# Altium schematic sheet LED_Wall [Audio].SchDoc
size Letter
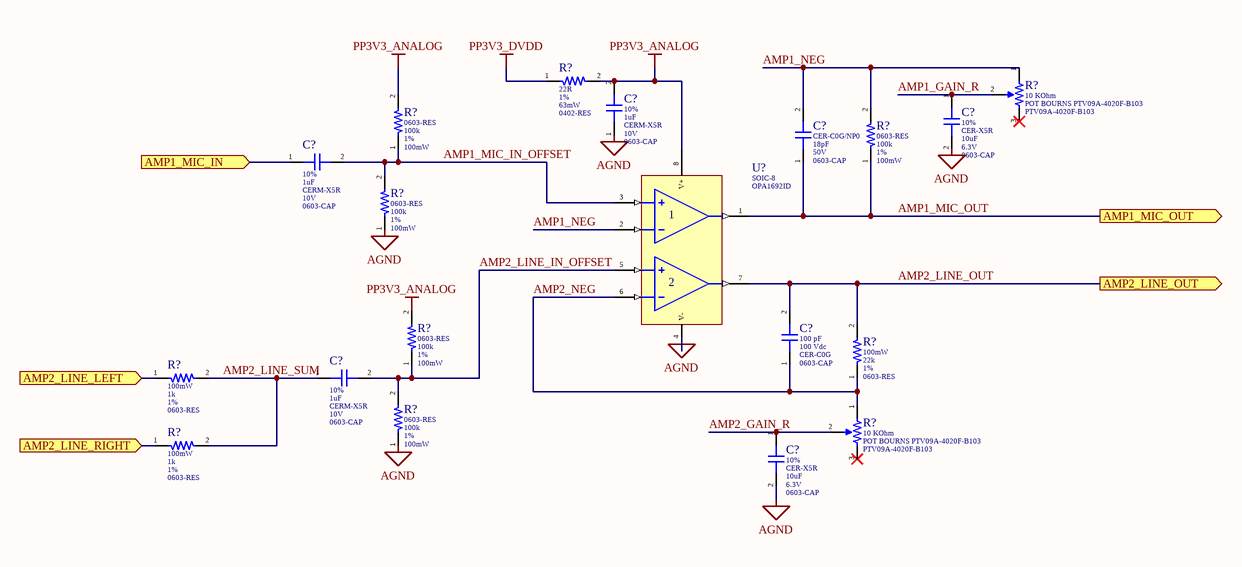
[diagram p0: LED_Wall [Audio].SchDoc]

## Parts
(Parts that share a designator on the sheet are numbered #1, #2 ... from top to bottom, then left to right.)
C?#1  Tolerance: 10%  Capacitance: 1uF  Dielectric: CERM-X5R  Voltage: 10V  [0603-CAP]  (hidden comment: CAP SAMSUNG CL10A105KP8NNNC)
C?#2  Tolerance: 10%  Dielectric: CER-X5R  Capacitance: 10uF  Voltage Rating: 6.3V  [0603-CAP]  (hidden comment: CAP MURATA GRM188R60J106KE47D)
C?#3  Dielectric: CER-C0G/NP0  Capacitance: 18pF  Voltage - Rated: 50V  [0603-CAP]  (hidden comment: CAP YAGEO CC0603JRNPO9BN180)
C?#4  Tolerance: 10%  Capacitance: 1uF  Dielectric: CERM-X5R  Voltage: 10V  [0603-CAP]  (hidden comment: CAP SAMSUNG CL10A105KP8NNNC)
C?#5  Capacitance Value: 100 pF  Voltage: 100 Vdc  Dielectric: CER-C0G  [0603-CAP]  (hidden comment: CAP KEMET C0603C101J1GACTU)
C?#6  Tolerance: 10%  Capacitance: 1uF  Dielectric: CERM-X5R  Voltage: 10V  [0603-CAP]  (hidden comment: CAP SAMSUNG CL10A105KP8NNNC)
C?#7  Tolerance: 10%  Dielectric: CER-X5R  Capacitance: 10uF  Voltage Rating: 6.3V  [0603-CAP]  (hidden comment: CAP MURATA GRM188R60J106KE47D)
R?#1  Resistance: 22R  Tolerance: 1%  Power Rating: 63mW  [0402-RES]  (hidden comment: RES YAGEO RC0402FR-0722RL)
R?#2  Resistance Value: 10 KOhm  Manufacturer Part Number: PTV09A-4020F-B103  [POT BOURNS PTV09A-4020F-B103]  (hidden comment: POT BOURNS PTV09A-4020F-B103)
R?#3  Resistance: 100k  Tolerance: 1%  Power: 100mW  [0603-RES]  (hidden comment: RES BOURNS CR0603AFX-1003EAS)
R?#4  Resistance: 100k  Tolerance: 1%  Power: 100mW  [0603-RES]  (hidden comment: RES BOURNS CR0603AFX-1003EAS)
R?#5  Resistance: 100k  Tolerance: 1%  Power: 100mW  [0603-RES]  (hidden comment: RES BOURNS CR0603AFX-1003EAS)
R?#6  Resistance: 100k  Tolerance: 1%  Power: 100mW  [0603-RES]  (hidden comment: RES BOURNS CR0603AFX-1003EAS)
R?#7  Power Rating: 100mW  Resistance: 22k  Tolerance: 1%  [0603-RES]  (hidden comment: RES KOA RK73H1JTTD2202F)
R?#8  Power Rating: 100mW  Resistance: 1k  Tolerance: 1%  [0603-RES]  (hidden comment: RES KOA RK73H1JTTD1001F)
R?#9  Resistance: 100k  Tolerance: 1%  Power: 100mW  [0603-RES]  (hidden comment: RES BOURNS CR0603AFX-1003EAS)
R?#10  Resistance Value: 10 KOhm  Manufacturer Part Number: PTV09A-4020F-B103  [POT BOURNS PTV09A-4020F-B103]  (hidden comment: POT BOURNS PTV09A-4020F-B103)
R?#11  Power Rating: 100mW  Resistance: 1k  Tolerance: 1%  [0603-RES]  (hidden comment: RES KOA RK73H1JTTD1001F)
U?  Manufacturer Part Number: OPA1692ID  [SOIC-8]  (hidden comment: IC TEXAS INSTRUMENTS OPA1692ID)

## Ports
AMP1_MIC_IN (in), AMP1_MIC_OUT (out), AMP2_LINE_LEFT (in), AMP2_LINE_OUT (out), AMP2_LINE_RIGHT (in)

## Nets
AGND: C?#1.1 C?#2.2 C?#7.2 R?#5.1 R?#9.1 U?.4(V-)
PP3V3_ANALOG: C?#1.2 R?#1.2 R?#3.2 R?#6.2 U?.8(V+)
PP3V3_DVDD: R?#1.1
AMP1_GAIN_R: C?#2.1 R?#2.2
AMP1_MIC_IN: C?#4.1 ; port AMP1_MIC_IN
AMP1_MIC_IN_OFFSET: C?#4.2 R?#3.1 R?#5.2 U?.3(+INA)
AMP1_MIC_OUT: C?#3.1 R?#4.1 U?.1(OUTA) ; port AMP1_MIC_OUT
AMP1_NEG: C?#3.2 R?#2.1 R?#4.2 U?.2(-INA)
AMP2_GAIN_R: C?#7.1 R?#10.2
AMP2_LINE_IN_OFFSET: C?#6.2 R?#6.1 R?#9.2 U?.5(+INB)
AMP2_LINE_LEFT: R?#8.1 ; port AMP2_LINE_LEFT
AMP2_LINE_OUT: C?#5.2 R?#7.2 U?.7(OUTB) ; port AMP2_LINE_OUT
AMP2_LINE_RIGHT: R?#11.1 ; port AMP2_LINE_RIGHT
AMP2_LINE_SUM: C?#6.1 R?#8.2 R?#11.2
AMP2_NEG: C?#5.1 R?#7.1 R?#10.1 U?.6(-INB)

Not connected (* = marked no-connect by the designer): R?#2 3*; R?#10 3*

## Notes on the sheet
- Title
- Size:
- Date:
- Letter
- Number:
- Time:
- Revision:
- Sheet
- of
- File:

## Library data of the parts
C?#1 C?#4 C?#6 = CAP SAMSUNG CL10A105KP8NNNC: CAP CER 1UF 10V X5R 0603; Supplier 1: Digi-Key; Manufacturer: Samsung; Manufacturer Part Number: CL10A105KP8NNNC; Stock 1: 4040315; Pricing 1: 1=0.1, 10=0.036, 100=0.0161, 500=0.0115, 1000=0.0091 (USD); Mount: Surface Mount; Case/Package: 0603; Case Code (Metric): 1608; Case Code (Imperial): 0603; Contact Plating: Tin; Min Operating Temperature: -55°C; Max Operating Temperature: 85°C; Packaging: Tape and Reel; Package Quantity: 1; Voltage Rating: 10V; Length: 1.6mm; Height: 0.8mm; Width: 0.031inch; Thickness: 0.035inch; Depth: 0.8mm; Radiation Hardening: No; ComponentLink1URL: https://www.verical.com/server-webapp/html/getDatasheet?partID=358616&src-supplier=Verical; ComponentLink1Description: https://www.verical.com/server-webapp/html/getDatasheet?partID=358616&src-supplier=Verical; ComponentLink2URL: http://www1.futureelectronics.com/doc/SAMSUNG%20PASSIVE/CL05B104KQ5NNNC.pdf?src-supplier=Future+Electronics; ComponentLink2Description: http://www1.futureelectronics.com/doc/SAMSUNG%20PASSIVE/CL05B104KQ5NNNC.pdf?src-supplier=Future+Electronics; Supplier Part Number 1: 1276-1182-1-ND; CurrentFootprint: 0603-CAP
C?#2 C?#7 = CAP MURATA GRM188R60J106KE47D: CAP CER 10UF 6.3V X5R 0603; Material: Ceramic; Supplier 1: Digi-Key; Manufacturer: Murata; Manufacturer Part Number: GRM188R60J106KE47D; Stock 1: 679118; Pricing 1: 1=0.17, 10=0.118, 100=0.0599, 500=0.041, 1000=0.0363 (USD); Mount: Surface Mount; Case/Package: 0603; Weight: 0.000222oz; Case Code (Metric): 1608; Case Code (Imperial): 0603; Min Operating Temperature: -55°C; Max Operating Temperature: 85°C; Packaging: Tape and Reel; Termination: SMD/SMT; Voltage Rating (DC): 6.3V; Package Quantity: 4000; Length: 1.6mm; Height: 0.8mm; Width: 0.031inch; Thickness: 0.035inch; Depth: 0.8mm; REACH SVHC: No SVHC; ComponentLink1URL: http://components.arrow.com/part/dataview/0323_06977919?src-supplier=Arrow+Europe; ComponentLink1Description: http://components.arrow.com/part/dataview/0323_06977919?src-supplier=Arrow+Europe; ComponentLink2URL: http://search.murata.co.jp/Ceramy/image/img/A01X/G101/ENG/GRM188R60J106KE47-02.pdf?src-supplier=Digi-Key; ComponentLink2Description: http://search.murata.co.jp/Ceramy/image/img/A01X/G101/ENG/GRM188R60J106KE47-02.pdf?src-supplier=Digi-Key; ComponentLink3URL: http://www.farnell.com/datasheets/1955679.pdf?src-supplier=Farnell; ComponentLink3Description: http://www.farnell.com/datasheets/1955679.pdf?src-supplier=Farnell; ComponentLink4URL: http://www.mouser.com/ds/2/281/c02e-2905.pdf?src-supplier=Mouser; ComponentLink4Description: http://www.mouser.com/ds/2/281/c02e-2905.pdf?src-supplier=Mouser; ComponentLink5URL: http://www.farnell.com/datasheets/1955679.pdf?src-supplier=Newark; ComponentLink5Description: http://www.farnell.com/datasheets/1955679.pdf?src-supplier=Newark; ComponentLink6URL: http://www.farnell.com/datasheets/1955679.pdf?src-supplier=Element14; ComponentLink6Description: http://www.farnell.com/datasheets/1955679.pdf?src-supplier=Element14; ComponentLink7URL: http://psearch.en.murata.com/capacitor/product/GRM188R60J106KE47%23.pdf?src-supplier=Avnet; ComponentLink7Description: http://psearch.en.murata.com/capacitor/product/GRM188R60J106KE47%23.pdf?src-supplier=Avnet; Supplier Part Number 1: 490-12538-1-ND; CurrentFootprint: 0603-CAP
C?#3 = CAP YAGEO CC0603JRNPO9BN180: CAP CER 18PF 50V C0G/NPO 0603; Product Training Modules: Multilayer Ceramic Capacitors; Featured Product: Commodity Multilayer Ceramic Capacitors – CC Series; Temperature Coefficient: C0G, NP0; Online Catalog: CC Series; Other Names: 311-1061-6 311-1279-6 311-1279-6-ND; Tolerance: ±5%; Supplier 1: Digi-Key; Supplier Part Number 1: 311-1061-1-ND; Manufacturer: Yageo; Stock 1: 146690; Pricing 1: 1=0.1, 10=0.047, 100=0.0208, 500=0.0149, 1000=0.0117 (USD); Standard Package: 1; Category: Capacitors; Family: Ceramic Capacitors; Series: CC; Packaging: Digi-Reel®; Mounting Type: Surface Mount, MLCC; Operating Temperature: -55°C ~ 125°C; Applications: General Purpose; Ratings: -; Package / Case: 0603 (1608 Metric); Size / Dimension: 0.063" L x 0.031" W (1.60mm x 0.80mm); Height - Seated (Max): -; Thickness (Max): 0.035" (0.90mm); Lead Spacing: -; Features: -; Lead Style: -; ComponentLink1URL: http://www.farnell.com/datasheets/1734582.pdf?src-supplier=Element14; ComponentLink1Description: http://www.farnell.com/datasheets/1734582.pdf?src-supplier=Element14; ComponentLink2URL: http://www.farnell.com/datasheets/2213336.pdf?src-supplier=Element14; ComponentLink2Description: http://www.farnell.com/datasheets/2213336.pdf?src-supplier=Element14; ComponentLink3URL: http://www.yageo.com/documents/recent/UPY-GP_NP0_16V-to-50V_8.pdf?src-supplier=Avnet; ComponentLink3Description: http://www.yageo.com/documents/recent/UPY-GP_NP0_16V-to-50V_8.pdf?src-supplier=Avnet; ComponentLink4URL: http://www.yageo.com/documents/recent/UPY-GP_NP0_16V-to-50V_16.pdf?src-supplier=Digi-Key; ComponentLink4Description: http://www.yageo.com/documents/recent/UPY-GP_NP0_16V-to-50V_16.pdf?src-supplier=Digi-Key; ComponentLink5URL: http://www.yageo.com/documents/recent/UPY-GP_NP0_16V-to-50V_8.pdf?src-supplier=Avnet+Europe; ComponentLink5Description: http://www.yageo.com/documents/recent/UPY-GP_NP0_16V-to-50V_8.pdf?src-supplier=Avnet+Europe; ComponentLink6URL: http://www.farnell.com/datasheets/1443161.pdf?src-supplier=Element14; ComponentLink6Description: http://www.farnell.com/datasheets/1443161.pdf?src-supplier=Element14; ComponentLink7URL: http://www.mouser.com/ds/2/447/Yageo_UPY-GP_NP0_16V-to-50V_9-358835.pdf?src-supplier=Mouser; ComponentLink7Description: http://www.mouser.com/ds/2/447/Yageo_UPY-GP_NP0_16V-to-50V_9-358835.pdf?src-supplier=Mouser; Manufacturer Part Number: CC0603JRNPO9BN180; CurrentFOotprint: 0603-CAP
C?#5 = CAP KEMET C0603C101J1GACTU: CAP CER 100PF 100V C0G/NP0 0603; Tolerance: 5 %; Product Length: 1.6 mm; Product Height: 0.8 mm; Supplier 1: Digi-Key; Supplier Part Number 1: 399-7821-1-ND; Manufacturer: KEMET; Stock 1: 129450; Pricing 1: 1=0.1, 10=0.06, 100=0.0267, 500=0.0191, 1000=0.015 (USD); Package/Case: 0603; Mounting: Surface Mount; Operating Temperature: -55 to 125 °C; Construction: Flat; Category: Capacitor Ceramic Multilayer; ComponentLink1URL: https://www.verical.com/server-webapp/html/getDatasheet?partID=308025&src-supplier=Verical; ComponentLink1Description: https://www.verical.com/server-webapp/html/getDatasheet?partID=308025&src-supplier=Verical; CurrentFootprint: 0603-CAP
R?#1 = RES YAGEO RC0402FR-0722RL: RES SMD 22 OHM 1% 1/16W 0402; Voltage Rating: 50V; Temperature Coefficient: 100ppm/°C; Supplier 1: Digi-Key; Manufacturer: Yageo; Manufacturer Part Number: RC0402FR-0722RL; Stock 1: 25342294; Pricing 1: 1=0.1, 10=0.016, 100=0.0064, 1000=0.0029, 2500=0.0025, 5000=0.0021 (USD); Case/Package: 0402; Number of Pins: 2; Case Code (Imperial): 0402; Case Code (Metric): 1005; Min Operating Temperature: -55°C; Max Operating Temperature: 155°C; Voltage Rating (DC): 50V; Packaging: Tape and Reel; Termination: SMD/SMT; Composition: Thick Film; Military Standard: Not; Length: 1mm; Height: 0.32mm; Width: 0.5mm; Depth: 0.5mm; REACH SVHC: Unknown; Lead Free: Lead Free; ComponentLink1URL: http://documents.rs-components.com/techlib://itc_doclist_GB.htm?stockno=6186374&src-supplier=RSComponents; ComponentLink1Description: http://documents.rs-components.com/techlib://itc_doclist_GB.htm?stockno=6186374&src-supplier=RSComponents; ComponentLink2URL: http://www.farnell.com/datasheets/2167052.pdf?src-supplier=Element14; ComponentLink2Description: http://www.farnell.com/datasheets/2167052.pdf?src-supplier=Element14; ComponentLink3URL: https://www.verical.com/server-webapp/html/getDatasheet?partID=554995&src-supplier=Verical; ComponentLink3Description: https://www.verical.com/server-webapp/html/getDatasheet?partID=554995&src-supplier=Verical; ComponentLink4URL: http://www.yageo.com/documents/recent/PYu-RC0402_51_RoHS_L_6_r.pdf?src-supplier=Future+Electronics; ComponentLink4Description: http://www.yageo.com/documents/recent/PYu-RC0402_51_RoHS_L_6_r.pdf?src-supplier=Future+Electronics; Supplier Part Number 1: 311-22.0LRDKR-ND; CurrentFootprint: 0402-RES
R?#2 R?#10 = POT BOURNS PTV09A-4020F-B103: POT 10K OHM 1/20W CARBON LINEAR; Number of Turns: 1(Elec)|1(Mech) Turns; Rad Hard: No; Shaft Diameter: 6 mm; Supplier 1: Digi-Key; Supplier Part Number 1: PTV09A-4020F-B103-ND; Manufacturer: Bourns; Stock 1: 626; Pricing 1: 1=0.83, 10=0.744, 25=0.672, 50=0.648, 100=0.612, 250=0.588, 500=0.552, 1000=0.456, 5000=0.372 (USD); Packaging: Bulk; Type: Potentiometer; Mounting: Bracket Mount/Through Hole; Technology: Carbon Film; Operating Temperature: -10 to 50 °C; ComponentLink1URL: https://www.bourns.com/docs/Product-Datasheets/PTV09.pdf?src-supplier=Digi-Key; ComponentLink1Description: https://www.bourns.com/docs/Product-Datasheets/PTV09.pdf?src-supplier=Digi-Key; ComponentLink2URL: http://uk.rs-online.com/webdocs/0fa5/0900766b80fa58ec.pdf?src-supplier=RSComponents; ComponentLink2Description: http://uk.rs-online.com/webdocs/0fa5/0900766b80fa58ec.pdf?src-supplier=RSComponents; Current Footprint: POT BOURNS PTV09A-4020F-B103
R?#3-R?#6 R?#9 = RES BOURNS CR0603AFX-1003EAS: RESA-AS 0603 100K 1% 100MW TC100; Supplier 1: Digi-Key; Manufacturer: Bourns; Manufacturer Part Number: CR0603AFX-1003EAS; Stock 1: 4900; Pricing 1: 1=0.1, 10=0.075, 100=0.0307, 1000=0.0138, 2500=0.012 (USD); Supplier Part Number 1: CR0603AFX-1003EASCT-ND; Current Footprint: 0603-RES
R?#7 = RES KOA RK73H1JTTD2202F: RES 22K OHM 1% 1/10W 0603; Manufacturer: KOA Speer; Voltage Rating: 50V; Temperature Coefficient: 100ppm/°C; Supplier 1: Digi-Key; Manufacturer Part Number: RK73H1JTTD2202F; Stock 1: 119057; Pricing 1: 1=0.1, 10=0.023, 100=0.0095, 1000=0.0043, 2500=0.0037 (USD); Case/Package: 0603; Number of Pins: 2; Case Code (Imperial): 0603; Case Code (Metric): 1608; Min Operating Temperature: -55°C; Max Operating Temperature: 155°C; Packaging: Tape and Reel; Package Quantity: 5000; Composition: Thick Film; Termination: SMD/SMT; Length: 1.6mm; Height: 0.45mm; Width: 0.8mm; REACH SVHC: Unknown; Lead Free: Lead Free; ComponentLink1URL: http://www.mouser.com/ds/2/219/RK73H-5715.pdf?src-supplier=Mouser; ComponentLink1Description: http://www.mouser.com/ds/2/219/RK73H-5715.pdf?src-supplier=Mouser; ComponentLink2URL: https://www.distrelec.biz/Web/Downloads/_t/ds/rk73h-series_eng_jap_tds.pdf?mime=application%2Fpdf&src-supplier=Distrelec; ComponentLink2Description: https://www.distrelec.biz/Web/Downloads/_t/ds/rk73h-series_eng_jap_tds.pdf?mime=application%2Fpdf&src-supplier=Distrelec; ComponentLink3URL: http://www.farnell.com/datasheets/549017.pdf?src-supplier=Element14; ComponentLink3Description: http://www.farnell.com/datasheets/549017.pdf?src-supplier=Element14; Supplier Part Number 1: 2019-RK73H1JTTD2202FCT-ND; Current Footprint: 0603-RES
R?#8 R?#11 = RES KOA RK73H1JTTD1001F: RES 1K OHM 1% 1/8W 0603; Manufacturer: KOA Speer; Voltage Rating: 50V; Temperature Coefficient: 100ppm/°C; Supplier 1: Digi-Key; Manufacturer Part Number: RK73H1JTTD1001F; Stock 1: 204222; Pricing 1: 1=0.1, 10=0.023, 100=0.0095, 1000=0.0043, 2500=0.0037 (USD); Case/Package: 0603; Number of Pins: 2; Case Code (Imperial): 0603; Case Code (Metric): 1608; Min Operating Temperature: -55°C; Max Operating Temperature: 155°C; Packaging: Tape and Reel; Package Quantity: 5000; Composition: Thick Film; Termination: SMD/SMT; Military Standard: Not; Voltage Rating (DC): 50V; Length: 1.6mm; Height: 0.45mm; Width: 0.8mm; Depth: 0.8mm; REACH SVHC: Unknown; Lead Free: Lead Free; ComponentLink1URL: https://www.verical.com/server-webapp/html/getDatasheet?partID=87490&src-supplier=Verical; ComponentLink1Description: https://www.verical.com/server-webapp/html/getDatasheet?partID=87490&src-supplier=Verical; ComponentLink2URL: https://www.distrelec.biz/Web/Downloads/_t/ds/rk73h-series_eng_jap_tds.pdf?mime=application%2Fpdf&src-supplier=Distrelec; ComponentLink2Description: https://www.distrelec.biz/Web/Downloads/_t/ds/rk73h-series_eng_jap_tds.pdf?mime=application%2Fpdf&src-supplier=Distrelec; Supplier Part Number 1: 2019-RK73H1JTTD1001FCT-ND; Current Footprint: 0603-RES
U? = IC TEXAS INSTRUMENTS OPA1692ID: IC AUDIO 2 CIRCUIT 8SOIC; Categories: Integrated Circuits (ICs); Number of Circuits: 2; Output Type: Rail-to-Rail; Slew Rate: 23 V/µs; Gain Bandwidth Product: 5.1MHz; Current - Input Bias: 300nA; Voltage - Input Offset: 250µV; Current - Supply: 650µA; Current - Output / Channel: 50mA; Voltage - Supply, Single/Dual (±): 3.5 V ~ 36 V, ±1.75 V ~ 18 V; Supplier 1: Digi-Key; Supplier Part Number 1: 296-52308-ND; Manufacturer: Texas Instruments; Stock 1: 143; Pricing 1: 1=2.02, 10=1.818, 25=1.7152, 100=1.372, 250=1.2005, 500=1.1662, 1000=0.9261, 2500=0.8918, 5000=0.8575 (USD); Series: SoundPlus™; Part Status: Active; Amplifier Type: Audio; Operating Temperature: -40°C ~ 85°C (TA); Mounting Type: Surface Mount; Package / Case: 8-SOIC (0.154, 3.90mm Width); Supplier Device Package: 8-SOIC; ComponentLink1URL: http://www.ti.com/lit/ds/symlink/opa1692.pdf?src-supplier=Digi-Key; ComponentLink1Description: http://www.ti.com/lit/ds/symlink/opa1692.pdf?src-supplier=Digi-Key; CurrentFootprint: SOIC-8